# EAGLE design inverter_power (EAGLE 4.16)
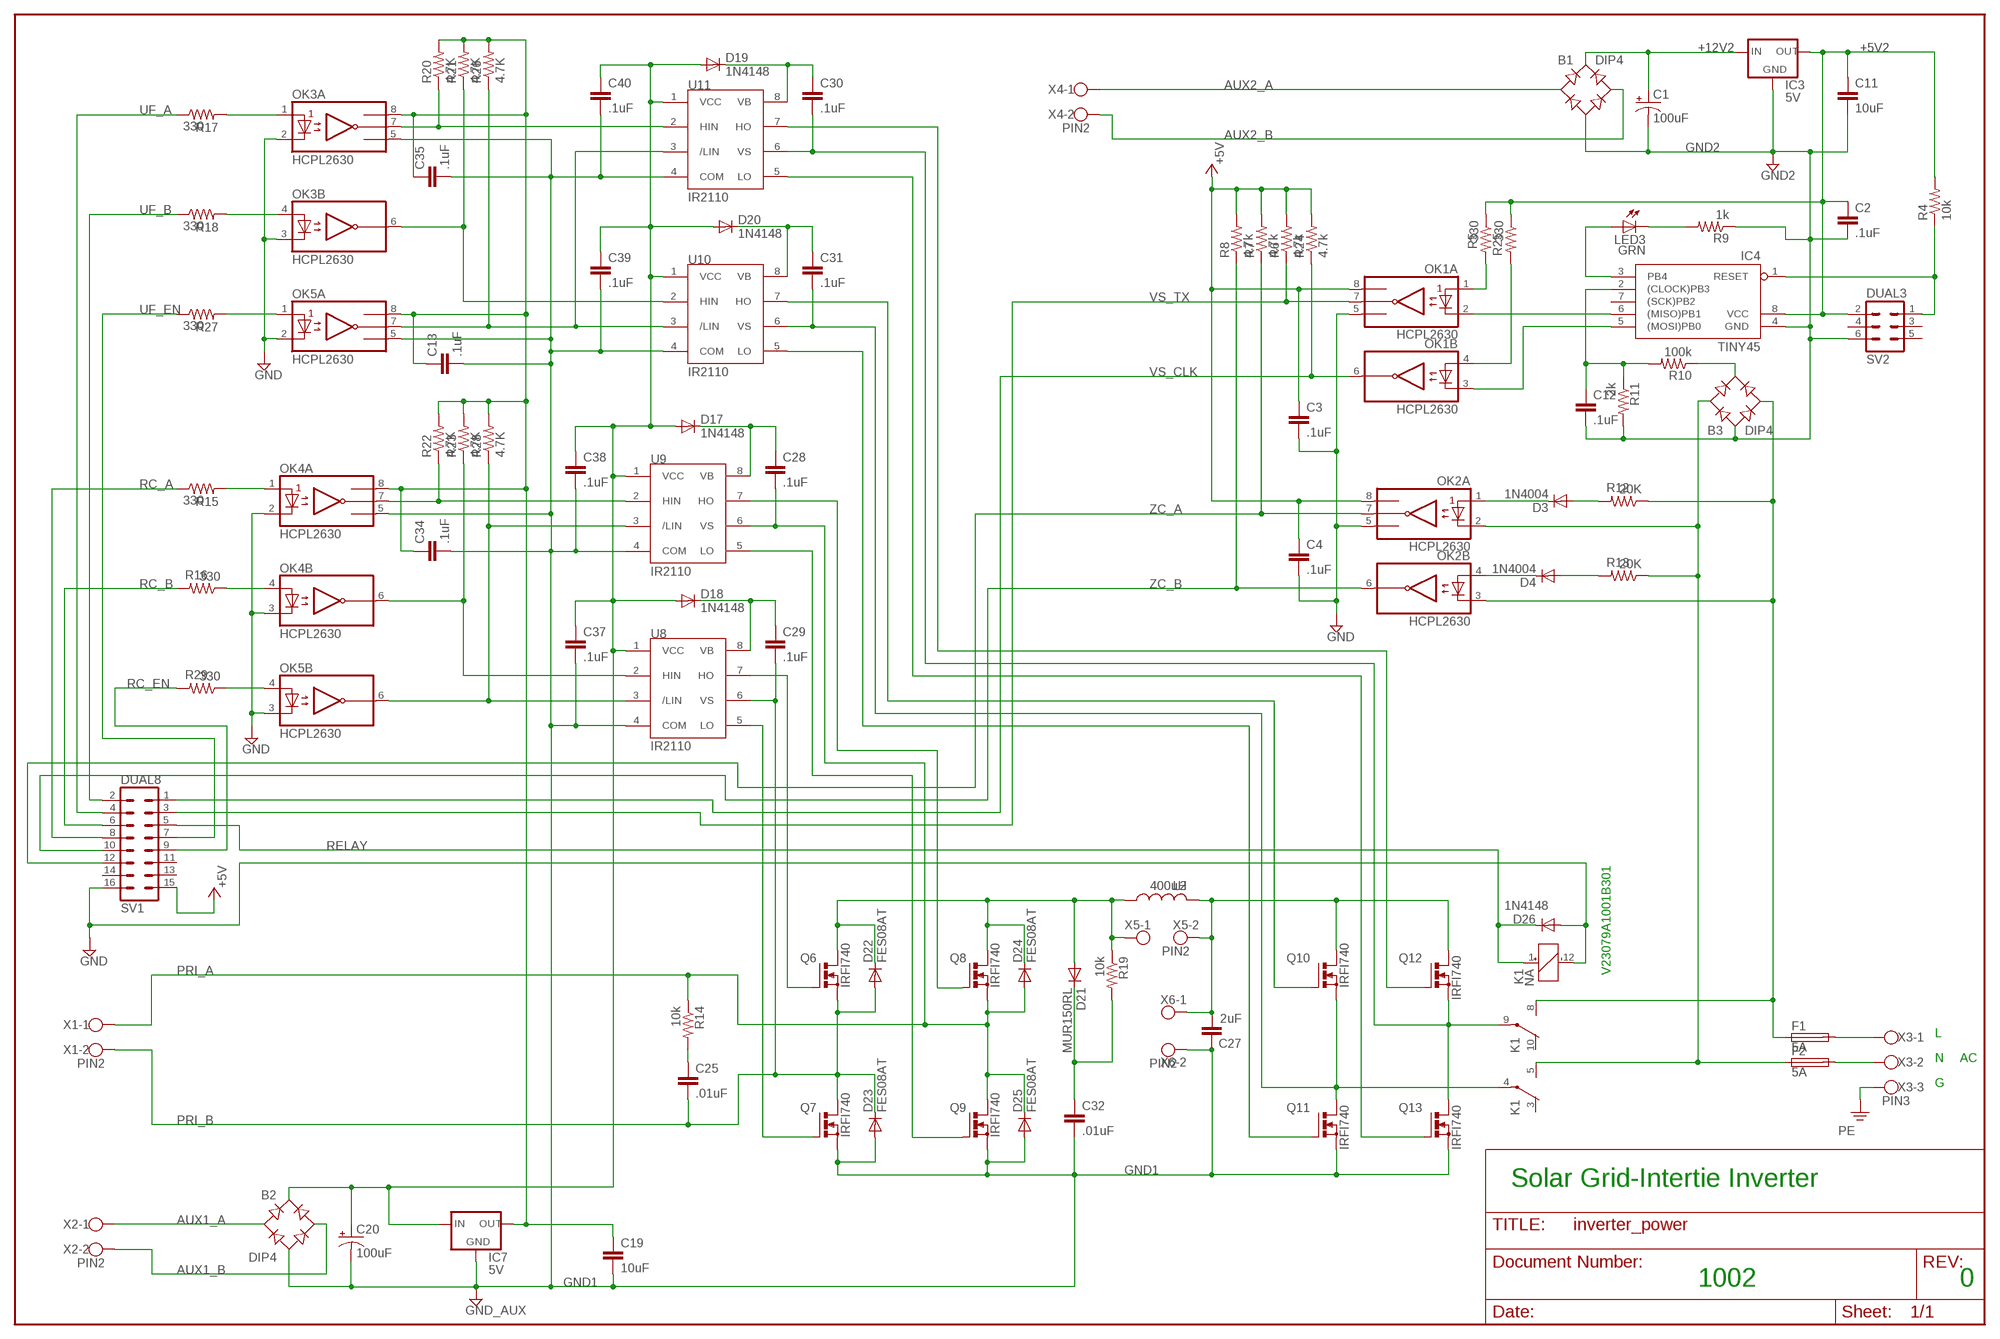
[diagram p0: schematic, sheet 1]

## Parts
B1  DIP4  B-DIL  [B-DIL]
B2  DIP4  B-DIL  [B-DIL]
B3  DIP4  B-DIL  [B-DIL]
C1  100uF  CPOL-USE5-10.5  [E5-10,5]
C2  .1uF  C2,5-3  [C2.5-3]
C3  .1uF  C2,5-3  [C2.5-3]
C4  .1uF  C2,5-3  [C2.5-3]
C11  10uF  C2,5-3  [C2.5-3]
C12  .1uF  C2,5-3  [C2.5-3]
C13  .1uF  C2,5-3  [C2.5-3]
C19  10uF  C2,5-3  [C2.5-3]
C20  100uF  CPOL-USE5-10.5  [E5-10,5]
C25  .01uF  C5/4.5  [C5B4.5]
C27  2uF  C22/8  [C22.5B8]
C28  .1uF  C2,5-3  [C2.5-3]
C29  .1uF  C2,5-3  [C2.5-3]
C30  .1uF  C2,5-3  [C2.5-3]
C31  .1uF  C2,5-3  [C2.5-3]
C32  .01uF  C5/4.5  [C5B4.5]
C34  .1uF  C2,5-3  [C2.5-3]
C35  .1uF  C2,5-3  [C2.5-3]
C37  .1uF  C2,5-3  [C2.5-3]
C38  .1uF  C2,5-3  [C2.5-3]
C39  .1uF  C2,5-3  [C2.5-3]
C40  .1uF  C2,5-3  [C2.5-3]
D3  1N4004  [DO41-10]
D4  1N4004  [DO41-10]
D17  1N4148  [DO35-10]
D18  1N4148  [DO35-10]
D19  1N4148  [DO35-10]
D20  1N4148  [DO35-10]
D21  MUR150RL  [DO41-10]
D22  FES08AT  [DO220S]
D23  FES08AT  [DO220S]
D24  FES08AT  [DO220S]
D25  FES08AT  [DO220S]
D26  1N4148  [DO35-10]
F1  5A  TR5  [TR5]
F2  5A  TR5  [TR5]
IC3  5V  78XXS  [78XXS]
IC4  TINY45  TINY22P  [DIL08]
IC7  5V  78XXS  [78XXS]
K1  NA  [NA]
L2  400uH  L-USTJ6-U1  [TJ6-U1]
LED3  GRN  LED3MM  [LED3MM]
OK1  HCPL2630  [DIL08]
OK2  HCPL2630  [DIL08]
OK3  HCPL2630  [DIL08]
OK4  HCPL2630  [DIL08]
OK5  HCPL2630  [DIL08]
Q6  IRFI740  PMOSFET_NTO220BV  [TO220BV]
Q7  IRFI740  PMOSFET_NTO220BV  [TO220BV]
Q8  IRFI740  PMOSFET_NTO220BV  [TO220BV]
Q9  IRFI740  PMOSFET_NTO220BV  [TO220BV]
Q10  IRFI740  PMOSFET_NTO220BV  [TO220BV]
Q11  IRFI740  PMOSFET_NTO220BV  [TO220BV]
Q12  IRFI740  PMOSFET_NTO220BV  [TO220BV]
Q13  IRFI740  PMOSFET_NTO220BV  [TO220BV]
R4  10k  R-US_0207/10  [0207/10]
R5  330  R-US_0207/10  [0207/10]
R6  4.7k  R-US_0207/10  [0207/10]
R7  4.7k  R-US_0207/10  [0207/10]
R8  4.7k  R-US_0207/10  [0207/10]
R9  1k  R-US_0207/10  [0207/10]
R10  100k  R-US_0207/10  [0207/10]
R11  2k  R-US_0207/10  [0207/10]
R12  20K  R-US_0207/10  [0207/10]
R13  20K  R-US_0207/10  [0207/10]
R14  10k  R-US_0617/5V  [0617V]
R15  330  R-US_0207/10  [0207/10]
R16  330  R-US_0207/10  [0207/10]
R17  330  R-US_0207/10  [0207/10]
R18  330  R-US_0207/10  [0207/10]
R19  10k  R-US_0617/5V  [0617V]
R20  4.7K  R-US_0207/10  [0207/10]
R21  4.7K  R-US_0207/10  [0207/10]
R22  4.7K  R-US_0207/10  [0207/10]
R23  4.7K  R-US_0207/10  [0207/10]
R24  4.7k  R-US_0207/10  [0207/10]
R25  330  R-US_0207/10  [0207/10]
R26  4.7K  R-US_0207/10  [0207/10]
R27  330  R-US_0207/10  [0207/10]
R28  4.7K  R-US_0207/10  [0207/10]
R29  330  R-US_0207/10  [0207/10]
SV1  DUAL8  MA08-2  [MA08-2]
SV2  DUAL3  MA03-2  [MA03-2]
U8  IR2110  IR2103  [DIL08]
U9  IR2110  IR2103  [DIL08]
U10  IR2110  IR2103  [DIL08]
U11  IR2110  IR2103  [DIL08]
X1  PIN2  W237-02P  [W237-132]
X2  PIN2  W237-02P  [W237-132]
X3  PIN3  W237-3E  [W237-3E]
X4  PIN2  W237-02P  [W237-132]
X5  PIN2  W237-02P  [W237-132]
X6  PIN2  W237-02P  [W237-132]

## Nets
+5V: C3.1 C4.1 OK1.8(A:VCC) OK2.8(A:VCC) R6.2 R7.2 R8.2 R24.2 SV1.15
+5V2: C2.1 C11.1 IC3.OUT IC4.8(VCC) R4.2 R5.1 R25.1 SV2.2
+5V_AUX: C13.1 C19.1 C34.1 C35.1 IC7.OUT OK3.8(A:VCC) OK4.8(A:VCC) OK5.8(A:VCC) R20.2 R21.2 R22.2 R23.2 R26.2 R28.2
+12V2: B1.+ C1.+ IC3.IN
+12V_AUX: B2.+ C20.+ C37.1 C38.1 C39.1 C40.1 D17.A D18.A D19.A D20.A IC7.IN U8.1(VCC) U9.1(VCC) U10.1(VCC) U11.1(VCC)
AUX1_A: B2.AC2 X2.1
AUX1_B: B2.AC1 X2.2
AUX2_A: B1.AC2 X4.1
AUX2_B: B1.AC1 X4.2
GND: C3.2 C4.2 D26.A K1.12(1:-) OK1.5(A:GND) OK2.5(A:GND) OK3.2(A:C1) OK3.3(B:C2) OK4.2(A:C1) OK4.3(B:C2) OK5.2(A:C1) OK5.3(B:C2) SV1.16
GND1: B2.- C13.2 C19.2 C20.- C27.1 C32.2 C34.2 C35.2 C37.2 C38.2 C39.2 C40.2 D23.A D25.A IC7.GND OK3.5(A:GND) OK4.5(A:GND) OK5.5(A:GND) Q7.S Q9.S Q11.S Q13.S U8.4(COM) U9.4(COM) U10.4(COM) U11.4(COM) X6.2 ; supply symbol labelled GND_AUX
GND2: B1.- B3.- C1.- C2.2 C11.2 C12.2 IC3.GND IC4.4(GND) R9.1 R11.2 SV2.6
N$9: OK4.1(A:A1) R15.2
N$22: D21.A D22.C D24.C L2.1 Q6.D Q8.D R19.1 X5.1
N$25: F1.2 X3.1
N$31: IC4.1(RESET) R4.1 SV2.1
N$33: B3.AC2 F1.1 K1.8(3:S) OK2.3(B:C2) R12.1
N$34: B3.AC1 F2.1 K1.5(2:S) OK2.2(A:C1) R13.1
N$36: OK5.7(A:VO1) R26.1 U10.3(/LIN) U11.3(/LIN)
N$37: IC4.6((MISO)PB1) OK1.2(A:C1)
N$38: IC4.3(PB4) LED3.A
N$39: OK5.1(A:A1) R27.2
N$40: OK5.4(B:A2) R29.1
N$42: LED3.K(C) R9.2
N$43: B3.+ R10.1
N$44: C12.1 IC4.2((CLOCK)PB3) R10.2 R11.1
N$45: D4.C OK2.4(B:A2)
N$46: D4.A R13.2
N$48: D3.A R12.2
N$49: D3.C OK2.1(A:A1)
N$50: OK1.1(A:A1) R5.2
N$52: OK1.4(B:A2) R25.2
N$53: IC4.5((MOSI)PB0) OK1.3(B:C2)
N$55: OK4.4(B:A2) R16.1
N$56: OK3.4(B:A2) R18.2
N$57: OK3.1(A:A1) R17.2
N$58: OK5.6(B:VO2) R28.1 U8.3(/LIN) U9.3(/LIN)
N$71: C25.1 R14.2
N$76: Q7.G U8.5(LO)
N$77: Q6.G U8.7(HO)
N$78: Q8.G U9.7(HO)
N$79: Q9.G U9.5(LO)
N$80: OK4.7(A:VO1) R22.1 U9.2(HIN)
N$81: OK4.6(B:VO2) R23.1 U8.2(HIN)
N$86: C30.2 K1.9(3:P) Q12.S Q13.D U11.6(VS)
N$87: C31.2 K1.4(2:P) Q10.S Q11.D U10.6(VS)
N$88: Q11.G U10.5(LO)
N$89: Q10.G U10.7(HO)
N$90: Q12.G U11.7(HO)
N$91: Q13.G U11.5(LO)
N$92: OK3.7(A:VO1) R20.1 U11.2(HIN)
N$93: OK3.6(B:VO2) R21.1 U10.2(HIN)
N$98: C32.1 D21.C R19.2
N$99: C27.2 L2.2 Q10.D Q12.D X5.2 X6.1
N$101: F2.2 X3.2
PE: X3.3
PRI_A: C28.2 D24.A D25.C Q8.S Q9.D R14.1 U9.6(VS) X1.1
PRI_B: C25.2 C29.2 D22.A D23.C Q6.S Q7.D U8.6(VS) X1.2
RC_A: R15.1 SV1.8
RC_B: R16.2 SV1.6
RC_EN: R29.2 SV1.9
RELAY: D26.C K1.1(1:+) SV1.5
UF_A: R17.1 SV1.4
UF_B: R18.1 SV1.2
UF_EN: R27.1 SV1.7
VBU8: C29.1 D18.C U8.8(VB)
VBU9: C28.1 D17.C U9.8(VB)
VBU10: C31.1 D20.C U10.8(VB)
VBU11: C30.1 D19.C U11.8(VB)
VS_CLK: OK1.6(B:VO2) R24.1 SV1.1
VS_TX: OK1.7(A:VO1) R6.1 SV1.3
ZC_A: OK2.7(A:VO1) R7.1 SV1.12
ZC_B: OK2.6(B:VO2) R8.1 SV1.10
Unconnected: IC4.7((SCK)PB2) K1.3(2:O) K1.10(3:O) SV1.11 SV1.13 SV1.14 SV2.3 SV2.4 SV2.5

## Notes on the sheet
- V23079A1001B301
- L
- N | AC
- G
- Solar Grid-Intertie Inverter
- 1002 | 0

## Library data of the parts
B1-B3 = rectifier:B-DIL: RECTIFIER
C1 C20 = rcl:CPOL-US: POLARIZED CAPACITOR, American symbol
C2-C4 C11-C13 C19 C25 C27-C32 C34 C35 C37-C40 = capacitor-wima:C: CAPACITOR naming: grid - package width
D3 D4 = diode:1N4004: DIODE general purpose rectifier, 1 A
D17-D20 D26 = diode:1N4148: DIODE high speed (Philips)
D21 = diode:MUR150RL: DIODE
D22-D25 = diode:FES08AT: DIODE ultra-fast recovery rectifier
F1 F2 = fuse:TR5: FUSE Wickmann
IC3 IC7 = v-reg:78XXS: VOLTAGE REGULATOR
IC4 = atmel:TINY22: MICROCONTROLLER 1K ROM 128 bytes RAM 128 bytes EEPROM
K1 = relay:NA: RELAY
L2 = rcl:L-US: INDUCTOR, American symbol
LED3 = led:LED: LED OSRAM: - CHIPLED LG R971, LG N971, LY N971, LG Q971, LY Q971, LO R971, LY R971 LH N974, LH R974 LS Q976, LO Q976, LY Q976 LO Q996 - Hyper CHIPLED LW Q18S LB Q993, LB Q99A, LB R99A - SideLED LS A670, LO A670, LY A670, LG A670, LP A670 LB A673, LV A673, LT A673, LW A673 LH A674 LY A675 LS A676, LA A676, LO A676, LY A676, LW A676 LS A679, LY A679, LG A679 - Hyper Micro SIDELED® LS Y876, LA Y876, LO Y876, LY Y876 LT Y87S - SmartLED LW L88C, LW L88S LB L89C, LB L89S, LG L890 LS L89K, LO L89K, LY L89K LS L896, LA L896, LO L896, LY L896 - TOPLED LS T670, LO T670, LY T670, LG T670, LP T670 LSG T670, LSP T670, LSY T670, LOP T670, LYG T670 LG T671, LOG T671, LSG T671 LB T673, LV T673, LT T673, LW T673 LH T674 LS T676, LA T676, LO T676, LY T676, LB T676, LH T676, LSB T676, LW T676 LB T67C, LV T67C, LT T67C, LS T67K, LO T67K, LY T67K, LW E67C LS E67B, LA E67B, LO E67B, LY E67B, LB E67C, LV E67C, LT E67C LW T67C LS T679, LY T679, LG T679 LS T770, LO T770, LY T770, LG T770, LP T770 LB T773, LV T773, LT T773, LW T773 LH T774 LS E675, LA E675, LY E675, LS T675 LS T776, LA T776, LO T776, LY T776, LB T776 LHGB T686 LT T68C, LB T68C - Hyper Mini TOPLED® LB M676 - Mini TOPLED Santana® LG M470 LS M47K, LO M47K, LY M47K Source: http://www.osram.convergy.de/
OK1-OK5 = optocoupler:HCPL2630: HEWLETT PACKARD OPTO COUPLER
Q6-Q13 = transistor-power:PMOSFET_N: Power MOSFET N-Channel
R4-R29 = rcl:R-US_: RESISTOR, American symbol
SV1 = con-lstb:MA08-2: PIN HEADER
SV2 = con-lstb:MA03-2: PIN HEADER
U8-U11 = irf-2:IR2103: High and low side driver
X1 X2 X4-X6 = con-wago-508:W237-02P: WAGO SREW CLAMP
X3 = con-wago-508:W237-3E: WAGO SREW CLAMP

## Board
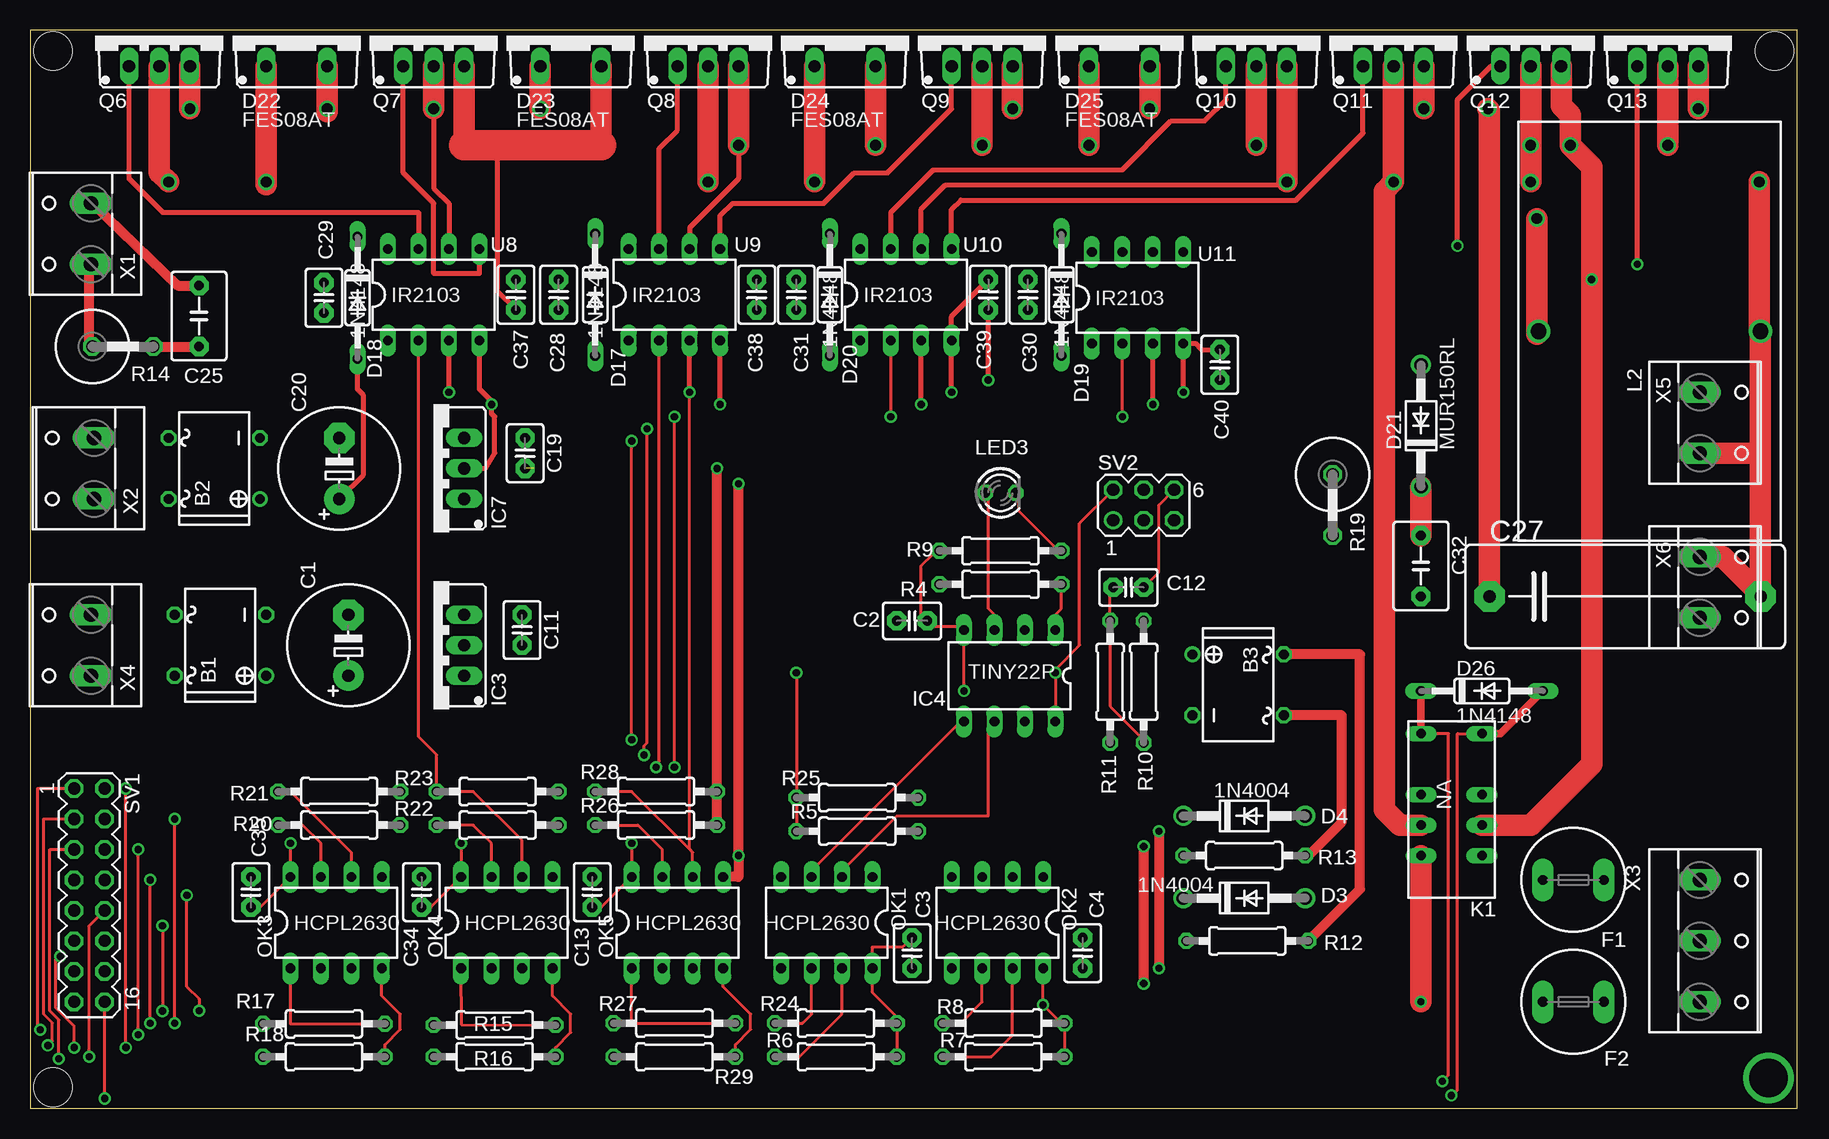
[diagram p1: board, top side]
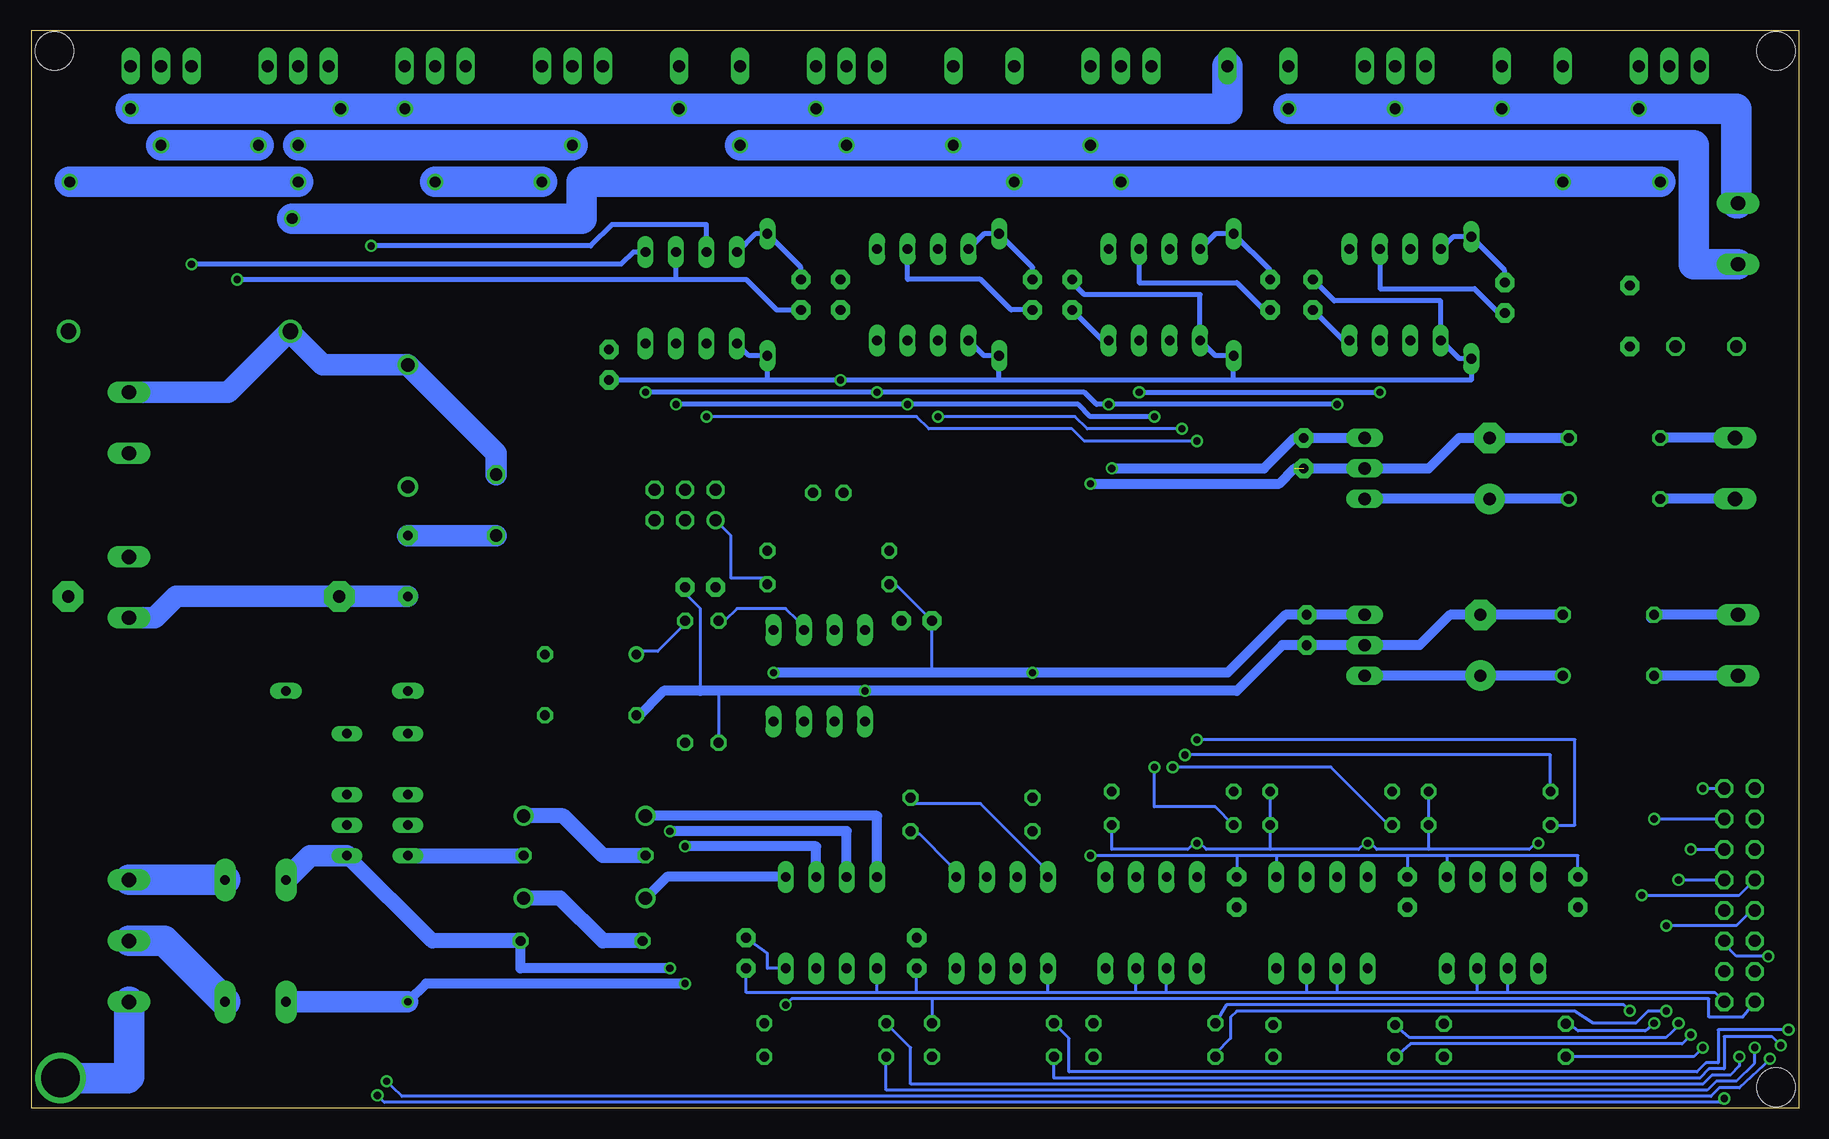
[diagram p2: board, bottom side, seen from below]

Size 147.3 x 89.84 mm. Coordinates in mm from the lower left corner, seen from the top.
Outline: 0,0 147.3,0 147.3,89.84 0,89.84 0,0
Copper layers (1*16): Top 0.035mm / dielectric 1.5mm / Bottom 0.035mm
Design rules "default": minimum track width 10mil, minimum drill 23mil, track to track 10mil, track to pad 10mil, pad to pad 10mil, via to via 10mil, smd to smd 10mil, copper to edge 10mil, drill to drill 10mil, minimum pad ring 10mil, minimum via ring 8mil, stop-mask expansion 4mil, vias tented up to drill 0mil, thermal gap 10mil
Holes 3.2 mm at 1.9,88.1 1.9,1.74 145.41,88.1

### Footprints (pad centres in the part's own frame; a part is rotated, then mirrored left to right if it is on the bottom)
B-DIL = drill 0.813 round: + -2.54,-3.81 | drill 0.813 octagon: - 2.54,-3.81; AC1 2.54,3.81; AC2 -2.54,3.81
E5-10,5 = drill 1.016 pad 2.54 round: + -2.54,0 | drill 1.016 pad 2.54 octagon: - 2.54,0
C2.5-3 = drill 0.813 pad 1.6 octagon: 1 -1.27,0; 2 1.27,0
C5B4.5 = drill 0.813 pad 1.6 octagon: 1 -2.54,0; 2 2.54,0
C22.5B8 = drill 1.016 pad 2.54 octagon: 1 -11.303,0; 2 11.303,0
DO41-10 = drill 1.118 round: A 5.08,0; C -5.08,0
DO35-10 = drill 0.813 long: A 5.08,0; C -5.08,0
DO220S = drill 1.016 long: A 2.54,-2.54; C -2.54,-2.54
TR5 = drill 0.813 pad 1.778 long: 1 -2.54,0; 2 2.54,0
78XXS = drill 1.016 long: GND 0,-2.54; IN -2.54,-2.54; OUT 2.54,-2.54
DIL08 = drill 0.813 long: 1 -3.81,-3.81; 2 -1.27,-3.81; 3 1.27,-3.81; 4 3.81,-3.81; 5 3.81,3.81; 6 1.27,3.81; 7 -1.27,3.81; 8 -3.81,3.81
NA = drill 0.8 long: 1 -6.35,-2.54; 3 -1.27,-2.54; 4 1.27,-2.54; 5 3.81,-2.54; 8 3.81,2.54; 9 1.27,2.54; 10 -1.27,2.54; 12 -6.35,2.54
TJ6-U1 = drill 1.3 round: 1 -9.25,0; 2 9.25,0
LED3MM = drill 0.813 octagon: A -1.27,0; K 1.27,0
TO220BV = drill 1.016 long: D 0,-2.54; G -2.54,-2.54; S 2.54,-2.54
0207/10 = drill 0.813 octagon: 1 -5.08,0; 2 5.08,0
0617V = drill 1.016 octagon: 1 -2.54,0; 2 2.54,0
MA08-2 = drill 1.016 octagon: 1 -8.89,-1.27; 2 -8.89,1.27; 3 -6.35,-1.27; 4 -6.35,1.27; 5 -3.81,-1.27; 6 -3.81,1.27; 7 -1.27,-1.27; 8 -1.27,1.27; 9 1.27,-1.27; 10 1.27,1.27; 11 3.81,-1.27; 12 3.81,1.27; 13 6.35,-1.27; 14 6.35,1.27; 15 8.89,-1.27; 16 8.89,1.27
MA03-2 = drill 1.016 round: 1 -2.54,-1.27 | drill 1.016 octagon: 2 -2.54,1.27; 3 0,-1.27; 4 0,1.27; 5 2.54,-1.27; 6 2.54,1.27
W237-132 = drill 1.194 long: 1 -2.54,-0.635; 2 2.54,-0.635
W237-3E = drill 1.194 long: 1 -5.08,-0.635; 2 0,-0.635; 3 5.08,-0.635

### Placement (x,y rotation side)
B1  15.87,38.57 90 top
B2  15.36,53.3 90 top
B3  100.71,35.27 270 top
C1  26.54,38.57 90 top
C2  73.53,40.6 0 top
C3  73.53,12.92 270 top
C4  87.75,12.92 270 top
C11  41.02,39.84 270 top
C12  91.56,43.4 0 top
C13  46.86,18 90 top
C19  41.27,54.57 270 top
C20  25.78,53.3 90 top
C25  14.09,66 90 top
C27  132.96,42.63 0 top
C28  44.06,67.78 270 top
C29  24.51,67.53 270 top
C30  83.18,67.78 270 top
C31  63.88,67.78 270 top
C32  115.95,45.17 270 top
C34  32.63,18 90 top
C35  18.41,18 90 top
C37  40.51,67.78 270 top
C38  60.57,67.78 270 top
C39  79.88,67.78 90 top
C40  99.18,61.94 90 top
D3  101.21,17.49 0 top
D4  101.21,24.35 0 top
D17  47.11,67.78 270 top
D18  27.3,67.53 270 top
D19  85.97,67.78 270 top
D20  66.67,67.78 270 top
D21  115.95,56.86 90 top
D22  22.22,89.37 0 top
D23  45.08,89.37 0 top
D24  67.94,89.37 0 top
D25  90.8,89.37 0 top
D26  121.03,34.76 0 top
F1  128.65,19.01 0 top
F2  128.65,8.85 0 top
IC3  33.65,38.57 90 top
IC4  81.66,36.03 180 top
IC7  33.65,53.3 90 top
K1  118.49,24.85 270 top
L2  135,64.73 0 top
LED3  80.89,51.27 0 top
OK1  66.42,15.46 180 top
OK2  80.64,15.46 180 top
OK3  25.52,15.46 0 top
OK4  39.75,15.46 0 top
OK5  53.97,15.46 0 top
Q6  10.79,89.37 0 top
Q7  33.65,89.37 0 top
Q8  56.51,89.37 0 top
Q9  79.37,89.37 0 top
Q10  102.23,89.37 0 top
Q11  113.66,89.37 0 top
Q12  125.09,89.37 0 top
Q13  136.52,89.37 0 top
R4  80.89,43.65 180 top
R5  68.96,23.08 0 top
R6  67.18,4.28 0 top
R7  81.15,4.28 0 top
R8  81.15,7.07 0 top
R9  80.89,46.44 0 top
R10  92.83,35.52 270 top
R11  90.04,35.52 270 top
R12  101.47,13.93 180 top
R13  101.21,21.04 180 top
R14  7.74,63.46 0 top
R15  38.73,6.92 0 top
R16  38.73,4.28 180 top
R17  24.51,7.02 0 top
R18  24.51,4.28 0 top
R19  108.58,50.25 270 top
R20  25.78,23.58 0 top
R21  25.78,26.38 0 top
R22  38.98,23.58 0 top
R23  38.98,26.38 0 top
R24  67.18,7.07 0 top
R25  68.96,25.87 0 top
R26  52.19,23.58 0 top
R27  53.72,7.07 0 top
R28  52.19,26.38 0 top
R29  53.72,4.28 180 top
SV1  4.95,17.74 270 top
SV2  92.83,50.25 0 top
U8  33.65,67.78 0 top
U9  53.72,67.78 0 top
U10  73.02,67.78 0 top
U11  92.32,67.53 0 top
X1  4.44,72.86 90 top
X2  4.69,53.3 90 top
X3  139.82,13.93 270 top
X4  4.44,38.57 90 top
X5  139.82,57.11 270 top
X6  139.82,43.4 270 top

### Tracks (layer width: path | path; a pad name or v marks a point on that pad's centre or on a via)
+5V  (via drill 0.6)
  Top 0.254: OK2.8 v84.45,8.6 85.97,7.07 R8.2 R7.2 | C3.1 72.77,13.42 70.23,13.42 OK1.8 70.23,9.61 72.26,7.58 R24.2 R6.2
  Bottom 0.254: SV1.15 4.69,7.58 7.49,7.58 7.49,9.11 72.26,9.11 | OK2.8 85.97,11.65 85.97,12.92 C4.1 | 72.26,9.11 83.94,9.11 v84.45,8.6 | 72.26,9.11 R24.2
+5V2  (via drill 0.6)
  Top 0.254: IC4.8 v85.47,36.28 85.47,36.54 87.5,38.57 87.5,48.73 SV2.2 | R5.1 R25.1 v63.88,36.28
  Bottom 0.254: R4.2 75.31,43.65 C2.1 72.26,36.28
  Bottom 0.813: IC3.OUT C11.1 42.79,41.11 47.62,36.28 v63.88,36.28 72.26,36.28 v85.47,36.28
+5V_AUX  (via drill 0.6)
  Top 0.254: C35.1 19.17,16.73 OK3.8 v21.71,22.06 | v50.16,22.06 OK5.8 47.62,16.73 C13.1 | v35.94,22.06 OK4.8 33.4,16.73 C34.1
  Top 0.813: v57.27,53.3 R28.2 R26.2
  Bottom 0.254: R26.2 57.27,21.55 50.92,21.55 50.41,22.06 v50.16,22.06 49.91,22.06 49.4,21.55 44.06,21.55 | v21.71,22.06 21.97,22.06 22.47,21.55 30.86,21.55 | 30.86,21.55 35.17,21.55 35.68,22.06 v35.94,22.06 36.19,22.06 36.7,21.55 44.06,21.55 | R23.2 R22.2 44.06,21.55 | R21.2 R20.2 30.86,21.55
  Bottom 0.813: IC7.OUT C19.1 42.03,55.84 44.57,53.3 v57.27,53.3
+12V2
  Bottom 0.813: B1.+ C1.+ | C1.+ 26.79,35.78 | C1.+ IC3.IN
+12V_AUX  (via drill 0.6)
  Top 0.406: C20.+ 27.81,52.79 27.81,59.4 27.3,59.91 D18.A | v79.88,60.67 C39.1
  Bottom 0.406: C37.1 38.73,67.27 29.84,67.27 U8.1 28.32,62.45 D18.A 27.3,60.67 47.11,60.67 | C38.1 60.83,69.05 59.56,67.78 49.91,67.78 U9.1 48.64,62.7 D17.A 47.11,60.67 | 66.67,60.67 D20.A 67.94,62.7 U10.1 | 47.11,60.67 66.67,60.67 | 85.97,60.67 D19.A 87.5,62.7 U11.1 | 66.67,60.67 v79.88,60.67 85.97,60.67 | 85.97,60.67 C40.1
  Bottom 0.813: B2.+ 25.52,50.76 25.78,50.51 C20.+ 35.94,50.76 36.19,51.02 IC7.IN
AUX1_A
  Bottom 0.813: X2.1 B2.AC2
AUX1_B
  Bottom 0.813: X2.2 B2.AC1
AUX2_A
  Bottom 0.813: 12.31,36.03 B1.AC2 X4.1
AUX2_B
  Bottom 0.813: X4.2 B1.AC1 12.31,40.86
GND  (via drill 0.6)
  Top 0.254: K1.12 118.99,31.2 118.99,1.49 118.56,1.05 v118.49,1.05 | v6.22,0.8 SV1.16
  Top 0.61: K1.12 122.55,31.2 D26.A
  Bottom 0.254: v6.22,0.8 6.57,0.47 117.9,0.47 v118.49,1.05 | SV1.16 6.98,9.61 24.25,9.61 | 24.25,9.61 26.79,9.61 | 26.79,9.61 38.48,9.61 | 38.48,9.61 41.02,9.61 | 41.02,9.61 52.7,9.61 | 52.7,9.61 55.24,9.61 | 55.24,9.61 62.61,9.61 | 62.61,9.61 73.53,9.61 | 73.53,9.61 76.83,9.61 | 76.83,9.61 87.75,9.61 C4.2 | 24.25,9.61 OK3.2 | 26.79,9.61 OK3.3 | 38.48,9.61 OK4.2 | 41.02,9.61 OK4.3 | 52.7,9.61 OK5.2 | 55.24,9.61 OK5.3 | 62.61,9.61 OK1.5 | 76.83,9.61 OK2.5 | 73.53,9.61 C3.2
GND1  (via drill 0.6, 0.9 pad 0.81)  (1 unrouted)
  Top 0.406: IC7.GND 37.97,53.3 38.73,54.57 38.73,57.62 38.47,57.88 38.47,58.12 | C37.2 38.98,68.03 38.98,80.23 | v57.53,58.64 U9.4 | 38.47,58.12 v38.48,58.64 38.48,58.89 37.46,59.91 U8.4 | 38.47,58.12 38.45,58.12 | v76.83,59.65 U10.4 76.83,66 C39.2 | v96.13,59.65 U11.4 97.15,63.72 97.66,63.21 C40.2
  Top 0.813: v59.05,52.03 v59.05,21.04 59.05,19.27 OK5.5
  Top 1.778: 36.19,80.23 Q7.S | 47.62,80.23 D23.A | v139.06,83.27 Q13.S | v116.2,83.27 Q11.S | v93.34,83.27 D25.A | v81.91,83.27 Q9.S | C27.1 121.66,83.15 v121.53,83.27
  Top 2.54: 36.19,80.23 38.98,80.23 47.62,80.23
  Bottom 0.254: 46.86,21.04 v59.05,21.04 | 46.86,21.04 C13.2 | 43.56,21.04 46.86,21.04 | 43.56,21.04 OK4.5 | 29.33,21.04 18.41,21.04 C35.2 | 29.33,21.04 32.63,21.04 | 32.63,21.04 43.56,21.04 | 29.33,21.04 OK3.5 | 32.63,21.04 C34.2
  Bottom 0.406: U8.4 37.97,63.97 C37.2 | v38.48,58.64 v57.53,58.64 58.54,58.64 59.56,59.65 v76.83,59.65 v96.13,59.65 | U9.4 58.03,63.97 C38.2
  Bottom 0.813: B2.- C20.- 28.32,55.84 30.86,53.3 IC7.GND 42.03,53.3 43.3,52.03 v59.05,52.03
  Bottom 1.778: 121.53,42.63 C32.2 | X6.2 137.03,40.86 135.25,42.63 121.53,42.63 | 121.53,42.63 C27.1
  Bottom 2.54: v139.06,83.27 v121.53,83.27 v116.2,83.27 v93.34,83.27 v81.91,83.27 47.62,83.27 D23.A
GND2  (via drill 0.6)
  Top 0.254: v77.85,34.76 IC4.4 77.34,40.09 75.31,40.09 C2.2 74.29,41.11 74.29,45.17 75.31,46.19 R9.1 | SV2.6 94.1,50.25 94.1,44.67 C12.2
  Bottom 0.254: 90.04,34.76 R11.2 | C12.2 92.58,42.63 91.56,41.62 91.56,34.76
  Bottom 0.813: B1.- C1.- 29.08,41.11 31.62,38.57 IC3.GND C11.2 43.05,38.57 46.86,34.76 v77.85,34.76 90.04,34.76 91.56,34.76 94.61,34.76 96.9,32.47 B3.-
N$9
  Top 0.254: R15.2 35.96,6.95 OK4.1
N$22  (via drill 0.9 pad 0.81)
  Top 1.778: Q6.D 10.79,77.94 v11.55,77.18 | v65.4,77.18 D24.C | D22.C v19.68,77.18 19.68,76.92 | v56.51,77.18 Q8.D | L2.1 125.75,64.63 125.6,64.48 v125.6,74.13
  Bottom 1.778: R19.1 108.58,54.57 D21.A 123.06,61.94 125.85,64.73 | L2.1 125.85,64.73 | X5.1 130.93,59.65 125.85,64.73
  Bottom 2.54: v11.55,77.18 v19.68,77.18 v56.51,77.18 v65.4,77.18 101.47,77.18 101.47,74.13 v125.6,74.13
N$25
  Bottom 2.54: F1.2 X3.1
N$31
  Top 0.254: IC4.1 85.47,41.11 85.97,41.62 R4.1
  Bottom 0.254: SV2.1 89.02,47.71 89.02,44.16 85.97,44.16 R4.1
N$33  (via drill 0.6)
  Top 0.813: R12.1 110.87,18.25 110.87,37.81 B3.AC2 | v94.1,23.08 v94.1,11.65
  Bottom 0.813: OK2.3 79.37,23.08 v94.1,23.08 | v94.1,11.65 106.55,11.65 R12.1
  Bottom 1.27: K1.8 113.91,13.93 R12.1
  Bottom 1.778: K1.8 124.07,21.04 F1.1
N$34  (via drill 0.6)
  Top 0.813: R13.1 106.55,21.04 109.34,23.84 109.34,32.73 B3.AC1 | v92.83,21.81 v92.83,10.38
  Top 1.778: v115.95,8.85 K1.5
  Bottom 0.813: OK2.2 81.91,21.81 v92.83,21.81 | v92.83,10.38 114.42,10.38 v115.95,8.85
  Bottom 1.27: K1.5 R13.1
  Bottom 1.778: v115.95,8.85 F2.1
N$36  (via drill 0.6)
  Top 0.254: OK5.7 52.7,21.55 50.67,23.58 R26.1 | v53.72,28.41 v53.72,57.62
  Top 0.406: v93.59,58.64 U11.3 | v74.29,58.64 U10.3
  Bottom 0.254: v53.72,28.41 53.72,25.11 48.64,25.11 R26.1
  Bottom 0.406: v93.59,58.64 v74.29,58.64 60.07,58.64 59.05,57.62 v53.72,57.62
N$37
  Top 0.254: OK1.2 68.19,20.28 72.26,24.35 79.88,24.35 79.88,31.46 IC4.6
N$38
  Top 0.254: IC4.3 80.39,41.11 79.88,41.62 79.88,50.76 LED3.A
N$39
  Top 0.254: R27.2 50.16,7.07 OK5.1
N$40
  Top 0.254: R29.1 58.8,5.3 60.07,6.57 60.07,7.84 57.78,10.12 OK5.4
N$42
  Top 0.254: R9.2 85.47,46.7 82.42,49.75 82.42,50.76 LED3.K
N$43
  Bottom 0.254: R10.1 93.09,40.09 95.12,38.06 96.64,38.06 B3.+
N$44
  Top 0.254: R10.2 92.58,30.95 90.04,33.49 R11.1 90.04,42.63 C12.1
  Bottom 0.254: IC4.2 83.43,40.6 84.45,41.62 88.51,41.62 89.53,40.6 R11.1
N$45
  Bottom 0.813: D4.C 76.83,24.35 OK2.4
N$46
  Bottom 1.27: R13.2 99.69,21.04 102.99,24.35 D4.A
N$48
  Bottom 1.27: R12.2 99.69,13.93 103.25,17.49 D3.A
N$49
  Bottom 0.813: D3.C 94.36,19.27 OK2.1
N$50
  Bottom 0.254: OK1.1 70.73,20.28 73.27,22.82 73.78,22.82 R5.2
N$52
  Bottom 0.254: OK1.4 63.11,20.28 68.19,25.36 73.78,25.36 R25.2
N$53
  Top 0.254: OK1.3 65.65,20.28 77.34,31.97 IC4.5
N$55
  Top 0.254: R16.1 43.81,5.04 45.08,6.31 45.08,7.84 43.56,9.36 OK4.4
N$56
  Top 0.254: R18.2 29.59,5.3 30.86,6.57 30.86,7.84 29.33,9.36 OK3.4
N$57
  Top 0.254: R17.2 21.71,7.02 21.71,11.39 21.97,11.65 OK3.1
N$58  (via drill 0.6)
  Top 0.254: OK5.6 55.24,21.3 54.99,21.55 | 54.99,21.55 50.16,26.38 R28.1 | 54.99,21.55 v54.99,59.65
  Top 0.406: v34.92,59.65 U8.3 | v54.99,59.65 U9.3
  Bottom 0.406: v54.99,59.65 v34.92,59.65
N$71
  Top 0.813: R14.2 C25.1
N$76
  Top 0.406: Q7.G 31.11,77.94 33.65,75.4 33.65,69.56 37.46,69.56 U8.5
N$77
  Top 0.406: Q6.G 8.25,77.43 11.04,74.64 32.38,74.64 U8.7
N$78
  Top 0.406: Q8.G 53.97,81.5 52.45,79.97 U9.7
N$79
  Top 0.406: Q9.G 76.83,83.27 71.5,77.94 68.7,77.94 66.16,75.4 58.54,75.4 57.53,74.38 U9.5
N$80  (via drill 0.6)
  Top 0.254: OK4.7 38.48,22.06 36.95,23.58 R22.1 | U9.2 52.45,28.92 v52.19,28.41
  Bottom 0.254: v52.19,28.41 38.98,28.41 34.16,23.58 R22.1
N$81
  Top 0.254: OK4.6 41.02,22.31 36.95,26.38 R23.1 33.9,29.43 32.38,30.95 U8.2
N$86  (via drill 0.6, 0.9 pad 0.81)
  Top 1.778: v136.52,80.23 Q13.D | Q12.S 127.63,83.53 128.39,82.77 v128.39,80.23 130.17,78.45 v130.17,69.05 130.17,28.66 125.09,23.58 K1.9
  Bottom 0.406: C30.2 85.21,66.51 87.75,69.05 93.59,69.05 | 93.59,69.05 U11.6 | v130.17,69.05 93.59,69.05
  Bottom 2.54: v128.39,80.23 v136.52,80.23
N$87  (via drill 0.9 pad 0.81)
  Top 0.406: U10.6 74.29,74.89 76.32,76.92 104.52,76.92 v104.77,77.18
  Top 1.778: v104.77,77.18 Q10.S | Q11.D v113.66,77.18 112.9,76.42 112.9,24.85 114.17,23.58 K1.4
  Bottom 0.406: C31.2 65.65,66.51 68.19,69.05 74.29,69.05 U10.6
  Bottom 2.54: v104.77,77.18 v113.66,77.18
N$88
  Top 0.406: Q11.G 111.12,81.24 105.53,75.65 77.59,75.65 76.83,74.89 U10.5
N$89
  Top 0.406: U10.7 71.75,74.64 75.31,78.19 91.05,78.19 95.12,82.26 97.91,82.26 99.69,84.04 Q10.G
N$90  (via drill 0.6)
  Top 0.406: Q12.G 121.79,86.83 118.99,84.04 v118.99,71.84
  Bottom 0.406: v118.99,71.84 100.71,71.84 98.93,73.62 91.05,73.62 U11.7
N$91  (via drill 0.6)
  Top 0.406: v133.98,70.32 Q13.G
  Bottom 0.406: U11.5 97.15,71.34 98.17,70.32 v133.98,70.32
N$92  (via drill 0.6)
  Top 0.254: OK3.7 24.25,22.06 22.73,23.58 R20.1 | v91.05,57.62 U11.2 | v50.16,30.7 v50.16,55.59
  Bottom 0.254: v91.05,57.62 73.53,57.62 72.51,56.6 60.57,56.6 59.56,55.59 v50.16,55.59 | v50.16,30.7 18.66,30.7 18.66,23.58 R20.1
N$93  (via drill 0.6)
  Top 0.254: OK3.6 26.79,21.3 21.71,26.38 R21.1 | v71.75,57.62 U10.2 | v51.18,29.43 51.18,30.19 51.43,30.44 v51.43,56.6
  Bottom 0.254: v71.75,57.62 60.32,57.62 59.3,56.6 v51.43,56.6 | v51.18,29.43 20.7,29.43 R21.1
N$98
  Top 1.778: C32.1 D21.C
  Bottom 1.778: R19.2 C32.1
N$99  (via drill 0.9 pad 0.81)
  Top 1.778: v102.23,80.23 Q10.D | Q12.D v125.09,80.23 v125.09,77.18 | v144.14,77.18 144.14,64.73 L2.2 144.25,54.57 | 144.25,54.57 144.25,42.74 144.14,42.63 C27.2 144.39,42.63 141.09,45.94 X6.1 | 144.25,54.57 X5.2
  Bottom 2.54: v102.23,80.23 v125.09,80.23 | v125.09,77.18 v144.14,77.18
N$101
  Bottom 2.54: F2.2 136.27,13.93 X3.2
PE  (via drill 3.2)
  Bottom 2.54: X3.3 139.19,2.63 139.31,2.5 v144.9,2.5
PRI_A  (via drill 0.9 pad 0.81)
  Top 0.406: v59.05,80.23 59.05,77.43 54.99,73.37 U9.6
  Top 0.813: X1.1 4.95,70.32 4.95,63.46 R14.1
  Top 1.778: v59.05,80.23 Q8.S | v70.48,80.23 D24.A | v79.37,80.23 Q9.D | v88.26,80.23 D25.C
  Bottom 0.406: C28.2 44.57,66.51 46.86,68.8 54.99,68.8 U9.6
  Bottom 2.54: X1.1 8.76,70.32 8.76,80.23 v59.05,80.23 v70.48,80.23 v79.37,80.23 v88.26,80.23
PRI_B  (via drill 0.9 pad 0.81)
  Top 0.406: v33.65,83.27 33.65,76.67 34.92,75.4 U8.6
  Top 0.813: X1.2 5.2,75.4 12.31,68.54 C25.2
  Top 1.778: v13.33,83.27 Q6.S | D22.A v24.76,83.27 24.76,83.02 | v42.54,83.27 D23.C | v33.65,83.27 Q7.D
  Bottom 0.406: C29.2 25.01,66.26 27.05,68.29 34.92,68.29 U8.6
  Bottom 2.54: X1.2 5.2,75.4 5.2,83.27 v13.33,83.27 v24.76,83.27 v33.65,83.27 v42.54,83.27
RC_A  (via drill 0.6)
  Top 0.254: v10.03,7.07 v10.03,19.01
  Bottom 0.254: v10.03,19.01 SV1.8 | R15.1 32.41,5.88 11.07,5.88 10.03,6.82 v10.03,7.07
RC_B  (via drill 0.6)
  Top 0.254: v9.01,6.11 v9.01,21.55
  Bottom 0.254: R16.2 32.38,5.35 9.72,5.35 9.01,6.06 v9.01,6.11 | v9.01,21.55 SV1.6
RC_EN  (via drill 0.6)
  Top 0.254: v11.04,15.2 v11.04,8.09
  Bottom 0.254: SV1.9 3.93,16.47 5.2,15.2 v11.04,15.2 | R29.2 48.64,4.53 47.37,5.8 47.37,7.58 46.86,8.09 18.66,8.09 17.14,7.07 13.58,7.07 12.57,8.09 v11.04,8.09
RELAY  (via drill 0.6)
  Top 0.254: K1.1 118.23,31.2 118.23,2.76 v117.72,2.25 | v2.41,4.1 2.41,7.35 1.65,8.12 1.65,21.55 SV1.5
  Top 0.61: K1.1 D26.C
  Bottom 0.254: v117.72,2.25 117.22,1.74 116.43,0.98 7.34,0.98 6.65,1.69 4.95,1.69 2.41,4.03 v2.41,4.1
UF_A  (via drill 0.6)
  Top 0.254: v12.06,7.07 v12.06,24.09
  Bottom 0.254: v12.06,7.07 12.8,6.44 18.38,6.44 19.17,7.07 R17.1 | v12.06,24.09 SV1.4
UF_B  (via drill 0.6)
  Top 0.254: v8,5.04 v8,26.63
  Bottom 0.254: v8,26.63 SV1.2 | v8,5.04 8.76,4.28 R18.1
UF_EN  (via drill 0.6)
  Top 0.254: v13.08,17.74 13.08,10.12 14.09,9.11 v14.09,8.12
  Bottom 0.254: SV1.7 4.95,17.74 v13.08,17.74 | v14.09,8.12 14.12,8.12 14.6,8.6 47.7,8.6 R27.1
VBU8
  Bottom 0.406: C29.1 24.51,69.81 D18.C 28.82,72.61 U8.8
VBU9
  Bottom 0.406: C28.1 44.06,69.81 D17.C 48.64,72.86 U9.8
VBU10
  Bottom 0.406: C31.1 63.88,70.07 D20.C 67.94,72.86 U10.8
VBU11
  Bottom 0.406: C30.1 83.18,70.07 D19.C 86.99,72.86 U11.8
VS_CLK  (via drill 0.6)
  Top 0.254: v0.86,6.51 0.63,6.82 0.63,26.63 SV1.1 | R24.1 64.38,7.07 65.15,7.84 OK1.6
  Bottom 0.254: R24.1 60.83,5.8 60.83,3.01 8.5,3.01 7.74,3.77 6.73,3.77 6.73,6.51 v0.86,6.51
VS_TX  (via drill 0.6)
  Top 0.254: SV1.3 1.14,24.09 1.14,7.84 1.88,7.1 1.88,5.6 v1.49,5.22 | R6.1 64.13,4.28 67.69,7.84 OK1.7
  Bottom 0.254: R6.1 62.1,2.5 8.25,2.5 7.49,3.26 6.22,3.26 6.22,5.96 2.23,5.96 v1.49,5.22
ZC_A  (via drill 0.6)
  Top 0.254: v3.68,5.04 3.68,6.82 2.15,8.34 2.15,12.41 v2.54,12.64 | R7.1 80.13,4.28 81.91,6.06 OK2.7
  Bottom 0.254: v3.68,5.04 3.68,3.75 5.2,2.25 6.88,2.25 7.64,1.49 76.07,1.49 R7.1 | v2.54,12.64 5.2,12.66 6.22,13.68 SV1.12
ZC_B  (via drill 0.6)
  Top 0.254: v4.95,4.28 4.95,15.2 SV1.10 | R8.1 77.59,7.07 79.37,8.85 OK2.6
  Bottom 0.254: v4.95,4.28 4.95,3.52 5.71,2.76 7.23,2.76 8,1.99 74.04,1.99 74.04,5.04 R8.1

### Text on the board
tDocu: Trans | Aux1 | Aux2 | L | N | G | Inverter Power Rev. A | copyright Tim Nolan 2008
_tsilk: Q6 | D22 | Q7 | D23 | Q8 | D24 | Q9 | D25 | Q10 | Q11 | Q12 | Q13 | FES08AT | FES08AT | FES08AT | FES08AT | C29 | U8 | U9 | U10 | U11 | 1N4148 | 1N4148 | X1 | 1N4148 | 1N4148 | IR2103 | IR2103 | IR2103 | IR2103 | D18 | C37 | C28 | C38 | C31 | C30 | D17 | D20 | D19 | C25 | C39 | R14 | X5 | L2 | C20 | C19 | C40 | LED3 | D21 | MUR150RL | SV2 | B2 | 6 | X2 | R19 | IC7 | C32 | C27 | X6 | 1 | R9 | C1 | R4 | C12 | C11 | C2 | B3 | TINY22P | D26 | B1 | X4 | IC3 | IC4 | 1N4148 | R11 | R10 | 1 | SV1 | R28 | NA | R23 | R25 | R21 | 1N4004 | R22 | R26 | R5 | R20 | D4 | R13 | C35 | X3 | OK1 | C3 | OK2 | C4 | 1N4004 | D3 | HCPL2630 | HCPL2630 | K1 | HCPL2630 | HCPL2630 | HCPL2630 | R12 | F1 | OK3 | OK4 | OK5 | C34 | C13 | 16 | R17 | R27 | R24 | R8 | R15 | R18 | R6 | R7 | R16 | R29 | F2